# EAGLE design schema (EAGLE 7.5.0)
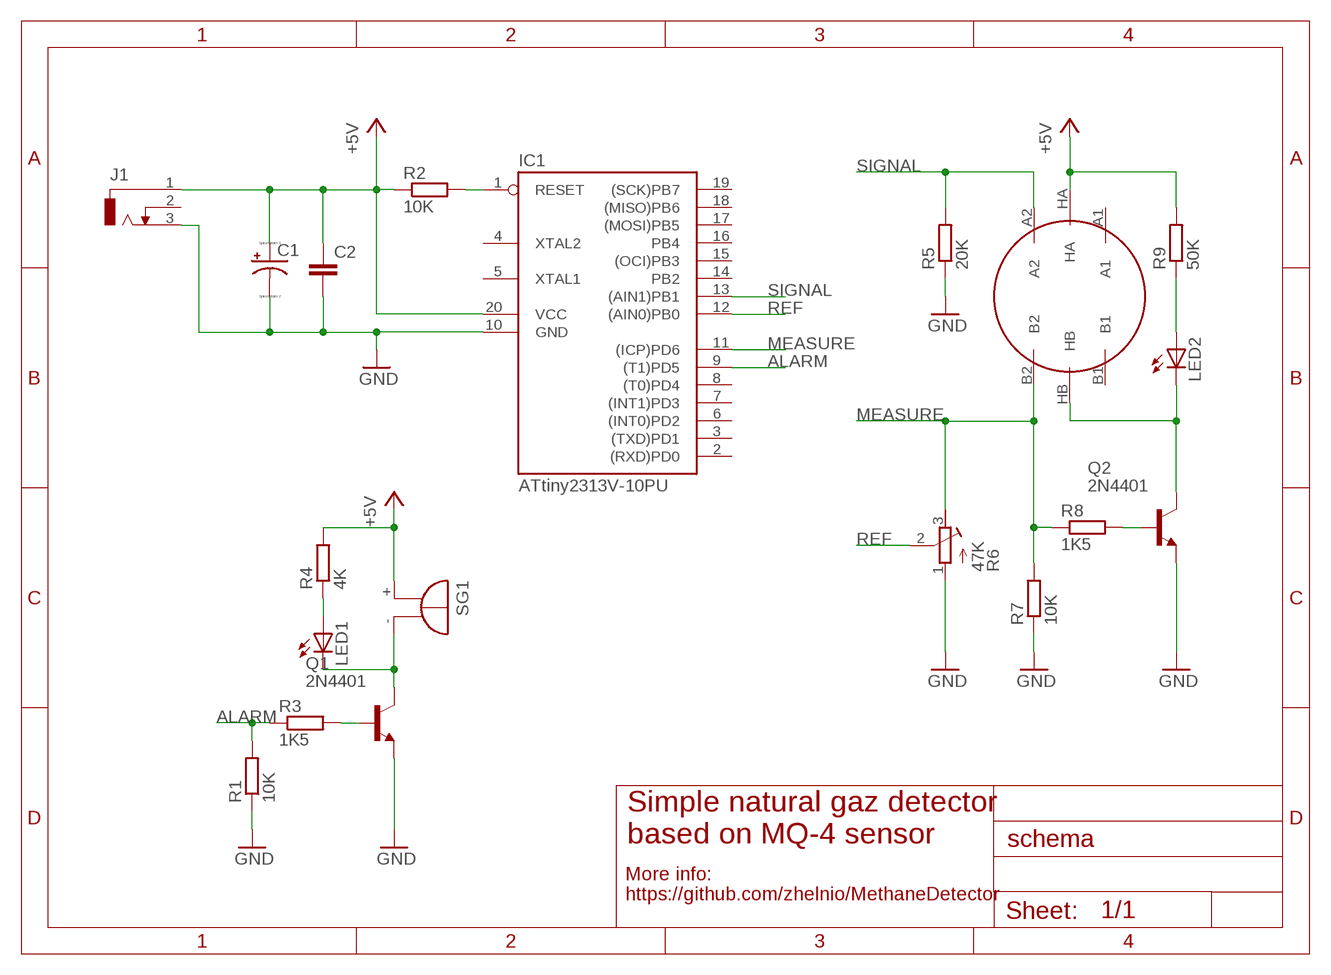
[diagram p0: schematic, sheet 1]

## Parts
C1  CPOL-USTT5D9L  [TT5D9L]
C2  C-EU050-030X075  [C050-030X075]
IC1  ATtiny2313V-10PU  AT90S2313P  [DIL20]
J1  DCJ0303  [DCJ0303]
LED1  LED3MM  [LED3MM]
LED2  LED3MM  [LED3MM]
Q1  2N4401  2N3904  [TO92]
Q2  2N4401  2N3904  [TO92]
R1  10K  R-EU_0207/10  [0207/10]
R2  10K  R-EU_0204/7  [0204/7]
R3  1K5  R-EU_0207/10  [0207/10]
R4  4K  R-EU_0207/10  [0207/10]
R5  20K  R-EU_0207/10  [0207/10]
R6  47K  R-TRIMM3296W  [RTRIM3296W]
R7  10K  R-EU_0207/10  [0207/10]
R8  1K5  R-EU_0207/10  [0207/10]
R9  50K  R-EU_0207/10  [0207/10]
SEN1  METHANE_SENSOR  [MQ-3]
SG1  BMT1205XH7.5  [BMT1205XH7.5]

## Nets
+5V: C1.+ C2.1 IC1.20(VCC) J1.1 R2.1 R4.2 R9.2 SEN1.HA SG1.+
ALARM: IC1.9((T1)PD5) R1.2 R3.1
GND: C1.- C2.2 IC1.10(GND) J1.3 Q1.3(E) Q2.3(E) R1.1 R5.1 R6.1(A) R7.1
MEASURE: IC1.11((ICP)PD6) R6.3(E) R7.2 R8.1 SEN1.B2
N$1: LED1.K(C) Q1.1(C) SG1.-
N$2: IC1.1(RESET) R2.2
N$3: LED1.A R4.1
N$4: Q1.2(B) R3.2
N$5: Q2.2(B) R8.2
N$6: LED2.K(C) Q2.1(C) SEN1.HB
N$9: LED2.A R9.1
REF: IC1.12((AIN0)PB0) R6.2(S)
SIGNAL: IC1.13((AIN1)PB1) R5.2 SEN1.A2
Unconnected: IC1.2((RXD)PD0) IC1.3((TXD)PD1) IC1.4(XTAL2) IC1.5(XTAL1) IC1.6((INT0)PD2) IC1.7((INT1)PD3) IC1.8((T0)PD4) IC1.14(PB2) IC1.15((OCI)PB3) IC1.16(PB4) IC1.17((MOSI)PB5) IC1.18((MISO)PB6) IC1.19((SCK)PB7) J1.2 SEN1.A1 SEN1.B1

## Notes on the sheet
- Simple natural gaz detector 
  based on MQ-4 sensor
- More info: 
  https://github.com/zhelnio/MethaneDetector

## Library data of the parts
C1 = resistor:CPOL-US: POLARIZED CAPACITOR, American symbol
C2 = resistor:C-EU: CAPACITOR, European symbol
IC1 = atmel:AT90S2313: MICROCONTROLLER 2 Kbytes FLASH 128 bytes SRAM 128 bytes EEPROM UART; OC_FARNELL: unknown; OC_NEWARK: unknown
J1 = con-jack:DCJ0303: DC POWER JACK Source: DCJ0303.pdf; OC_FARNELL: unknown; OC_NEWARK: unknown
LED1 LED2 = adafruit:LED: LED OSRAM: - CHIPLED LG R971, LG N971, LY N971, LG Q971, LY Q971, LO R971, LY R971 LH N974, LH R974 LS Q976, LO Q976, LY Q976 LO Q996 - Hyper CHIPLED LW Q18S LB Q993, LB Q99A, LB R99A - SideLED LS A670, LO A670, LY A670, LG A670, LP A670 LB A673, LV A673, LT A673, LW A673 LH A674 LY A675 LS A676, LA A676, LO A676, LY A676, LW A676 LS A679, LY A679, LG A679 - Hyper Micro SIDELED® LS Y876, LA Y876, LO Y876, LY Y876 LT Y87S - SmartLED LW L88C, LW L88S LB L89C, LB L89S, LG L890 LS L89K, LO L89K, LY L89K LS L896, LA L896, LO L896, LY L896 - TOPLED LS T670, LO T670, LY T670, LG T670, LP T670 LSG T670, LSP T670, LSY T670, LOP T670, LYG T670 LG T671, LOG T671, LSG T671 LB T673, LV T673, LT T673, LW T673 LH T674 LS T676, LA T676, LO T676, LY T676, LB T676, LH T676, LSB T676, LW T676 LB T67C, LV T67C, LT T67C, LS T67K, LO T67K, LY T67K, LW E67C LS E67B, LA E67B, LO E67B, LY E67B, LB E67C, LV E67C, LT E67C LW T67C LS T679, LY T679, LG T679 LS T770, LO T770, LY T770, LG T770, LP T770 LB T773, LV T773, LT T773, LW T773 LH T774 LS E675, LA E675, LY E675, LS T675 LS T776, LA T776, LO T776, LY T776, LB T776 LHGB T686 LT T68C, LB T68C - Hyper Mini TOPLED® LB M676 - Mini TOPLED Santana® LG M470 LS M47K, LO M47K, LY M47K Source: http://www.osram.convergy.de/
Q1 Q2 = transistor-npn:2N3904: NPN Transistor
R1-R5 R7-R9 = resistor:R-EU_: RESISTOR, European symbol
R6 = resistor:R-TRIMM: Trimm resistor
SEN1 = SparkFun-Sensors:METHANE_SENSOR: MQ-4 Methane Gas Sensor SEN-09404
SG1 = buzzer:BMT1205XH7.5: MAGNETIC TRANSDUCER Source: Http:www.be-star.com; OC_FARNELL: unknown; OC_NEWARK: unknown

## Board
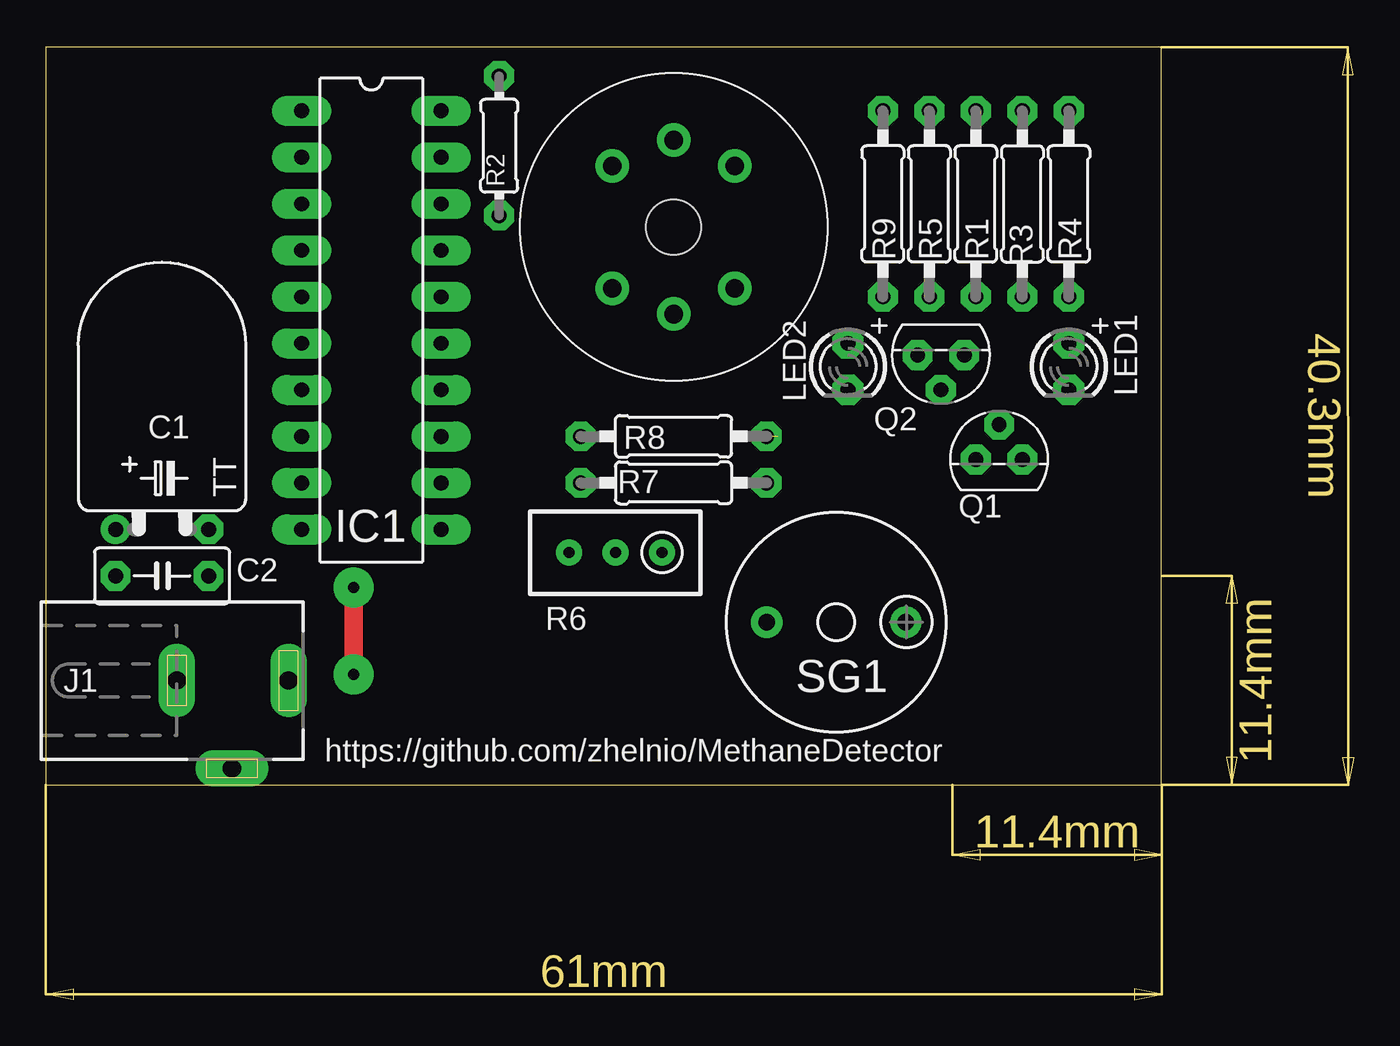
[diagram p1: board, top side]
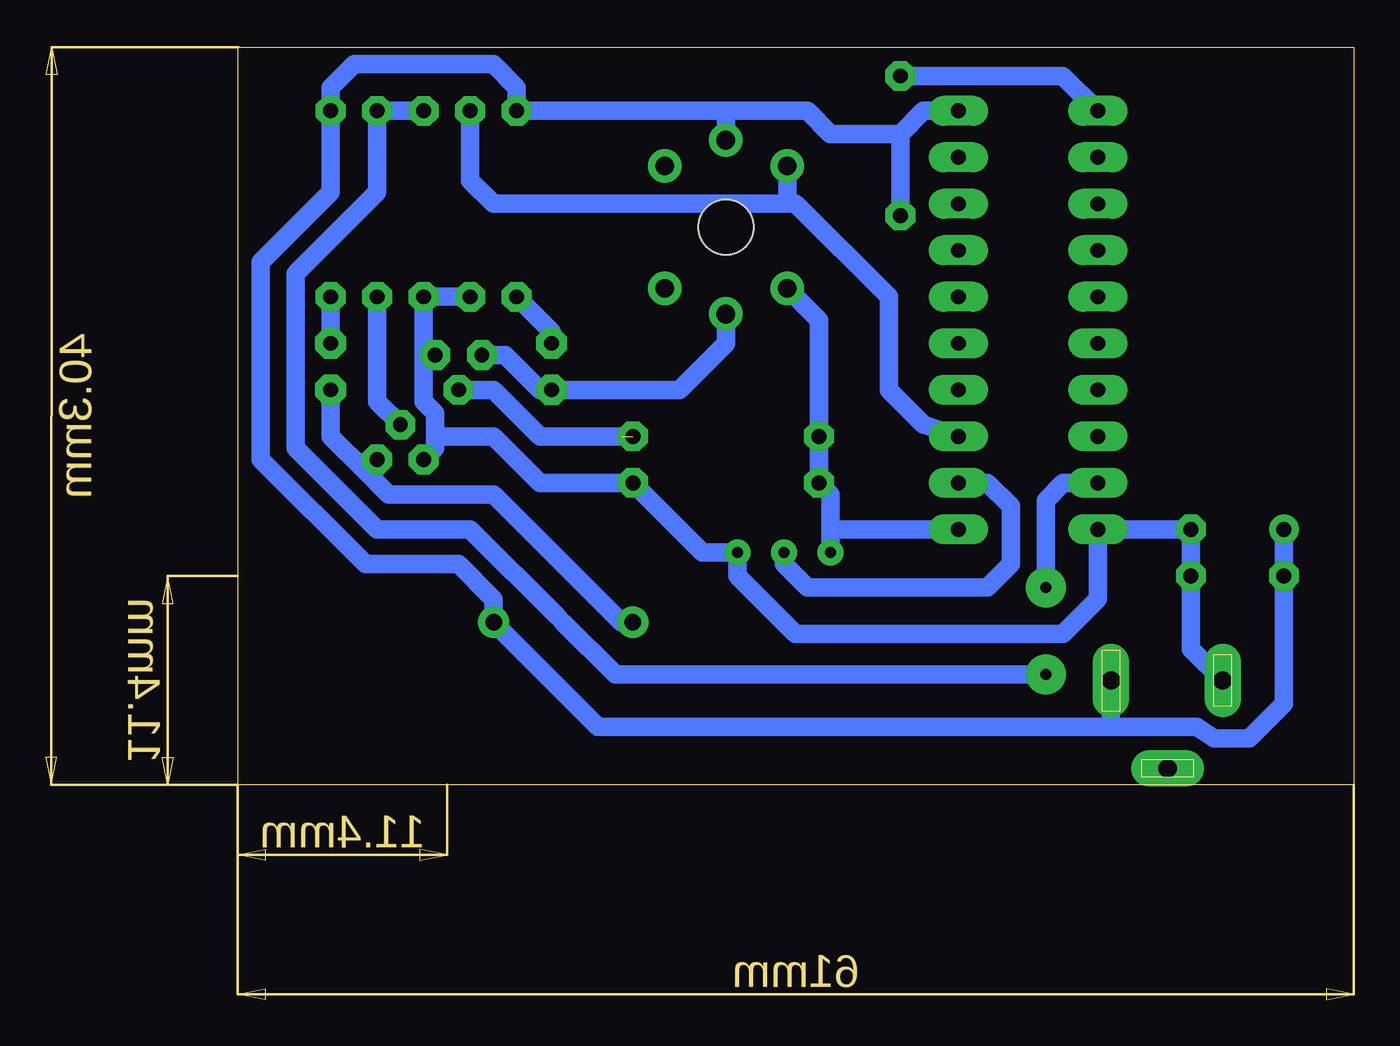
[diagram p2: board, bottom side, seen from below]

Size 60.94 x 40.31 mm. Coordinates in mm from the lower left corner, seen from the top.
Outline: 0,0 60.94,0 60.94,40.31 0,40.31 0,0
Copper layers (1*16): Top 0.035mm / dielectric 1.5mm / Bottom 0.035mm
Design rules "default *": minimum track width 10mil, minimum drill 24mil, track to track 12mil, track to pad 12mil, pad to pad 12mil, via to via 12mil, smd to smd 8mil, copper to edge 40mil, drill to drill 12mil, minimum pad ring 16mil, minimum via ring 16mil, stop-mask expansion 4mil, vias tented up to drill 0mil, thermal gap 10mil
bKeepout: area 0,28.6 to 11.4,40; area 49.5,0 to 61,11.4

### Footprints (pad centres in the part's own frame; a part is rotated, then mirrored left to right if it is on the bottom)
TT5D9L = drill 0.813 pad 1.6: + -2.54,0 | drill 0.813 pad 1.6 octagon: - 2.54,0
C050-030X075 = drill 0.813 octagon: 1 -2.54,0; 2 2.54,0
DIL20 = drill 0.813 long: 1 -11.43,-3.81; 2 -8.89,-3.81; 3 -6.35,-3.81; 4 -3.81,-3.81; 5 -1.27,-3.81; 6 1.27,-3.81; 7 3.81,-3.81; 8 6.35,-3.81; 9 8.89,-3.81; 10 11.43,-3.81; 11 11.43,3.81; 12 8.89,3.81; 13 6.35,3.81; 14 3.81,3.81; 15 1.27,3.81; 16 -1.27,3.81; 17 -3.81,3.81; 18 -6.35,3.81; 19 -8.89,3.81; 20 -11.43,3.81
DCJ0303 = drill 1 pad 2 long: 1 0,3.1; 2 4.8,0; 3 0,-3
LED3MM = drill 0.813 pad 1.676 octagon: A -1.27,0; K 1.27,0
TO92 = drill 0.813 octagon: 1 1.27,0; 2 0,1.905; 3 -1.27,0
0207/10 = drill 0.813 octagon: 1 -5.08,0; 2 5.08,0
0204/7 = drill 0.813 octagon: 1 -3.81,0; 2 3.81,0
RTRIM3296W = drill 0.61: 1 0,-2.54; 2 0,0; 3 0,2.54
MQ-3 = drill 1.016: A1 -3.35,3.35; A2 -3.35,-3.35; B1 3.35,3.35; B2 3.35,-3.35; HA -4.75,0; HB 4.75,0 | hole 3: 0,0
BMT1205XH7.5 = drill 0.9 pad 1.5: + 3.8,0; - -3.8,0

### Placement (x,y rotation side)
C1  6.35,13.97 0 top
C2  6.35,11.43 0 top
IC1  17.78,25.4 270 top
J1  10.16,5.71 270 top
LED1  55.88,22.86 270 top
LED2  43.81,22.86 270 top
Q1  52.07,17.78 0 top
Q2  48.9,23.5 180 top
R1  50.8,31.75 90 top
R2  24.77,34.92 90 top
R3  53.34,31.75 270 top
R4  55.88,31.75 90 top
R5  48.26,31.75 90 top
R6  31.11,12.7 90 top
R7  34.29,16.51 180 top
R8  34.29,19.05 0 top
R9  45.72,31.75 90 top
SEN1  34.29,30.48 270 top
SG1  43.18,8.89 0 top

### Tracks (layer width: path | path; a pad name or v marks a point on that pad's centre or on a via)
+5V
  Bottom 1.016: 34.29,36.83 R9.2 45.72,38.1 46.99,39.37 54.61,39.37 55.88,38.1 R4.2 55.88,32.38 59.69,28.57 59.69,17.78 53.98,12.06 48.9,12.06 46.98,10.15 SG1.+ 41.27,3.17 13.34,3.17 | SEN1.HA 34.29,36.83 | C1.+ C2.1 3.81,4.45 5.71,2.54 7.62,2.54 8.57,3.17 13.34,3.17 | J1.1 13.26,3.25 13.34,3.17 | IC1.20 23.5,36.83 24.77,35.56 | 24.77,35.56 28.57,35.56 29.84,36.83 34.29,36.83 | R2.1 24.77,35.56
ALARM  (via drill 0.6 pad 2.18)
  Top 1.016: v16.83,10.79 v16.83,6.03
  Bottom 1.016: R1.2 R3.1 53.34,32.38 57.78,27.94 57.78,18.41 53.34,13.97 48.26,13.97 43.5,9.21 43.18,8.89 40.32,6.03 v16.83,6.03 | IC1.9 15.88,16.51 16.83,15.56 v16.83,10.79
GND
  Bottom 1.016: R5.1 R1.1 50.8,23.5 | 50.16,19.05 50.16,20.32 50.8,20.95 50.8,23.5 | 50.16,19.05 46.99,19.05 44.45,16.51 R7.1 35.56,12.7 R6.1 33.66,11.43 30.48,8.26 15.88,8.26 13.97,10.16 IC1.10 C1.- C2.2 8.89,7.45 J1.3 | 50.16,19.05 50.16,18.41 Q1.3 | Q2.3 50.8,23.5
MEASURE
  Bottom 1.016: R6.3 28.57,13.97 | 28.57,13.97 28.57,15.88 R7.2 R8.1 29.21,25.4 SEN1.B2 | IC1.11 28.57,13.97
N$1
  Bottom 1.016: LED1.K 55.88,19.05 53.98,17.14 | 53.98,17.14 52.7,15.88 46.99,15.88 40.01,8.89 SG1.- | Q1.1 53.98,17.14
N$2
  Bottom 1.016: IC1.1 15.88,38.73 R2.2
N$3
  Bottom 1.016: LED1.A R4.1
N$4
  Bottom 1.016: Q1.2 53.34,20.95 R3.2
N$5  (1 unrouted)
  Bottom 1.016: 40.01,19.05 44.45,19.05 46.99,21.59 Q2.2
N$6
  Bottom 1.016: SEN1.HB 34.29,24.13 36.83,21.59 LED2.K 44.45,21.59 46.35,23.5 Q2.1
N$9
  Bottom 1.016: LED2.A 43.81,24.77 R9.1
REF
  Bottom 1.016: R6.2 31.11,12.06 29.84,10.79 20,10.79 18.73,12.06 18.73,15.24 20,16.51 IC1.12
SIGNAL
  Bottom 1.016: R5.2 48.26,33.02 46.99,31.75 31.11,31.75 | 31.11,31.75 30.48,31.75 25.4,26.67 25.4,21.59 23.5,19.68 IC1.13 | SEN1.A2 30.94,31.93 31.11,31.75

### Text on the board
tNames: https://github.com/zhelnio/MethaneDetector